# EasyEDA schematic SCH_wiring_diagram_phws_2026-05-13.json
TITLE: Wiring Diagram - Transmitter; REV: 1.0; Date: 2026-05-13; Sheet: 1/1; Drawn By: CES
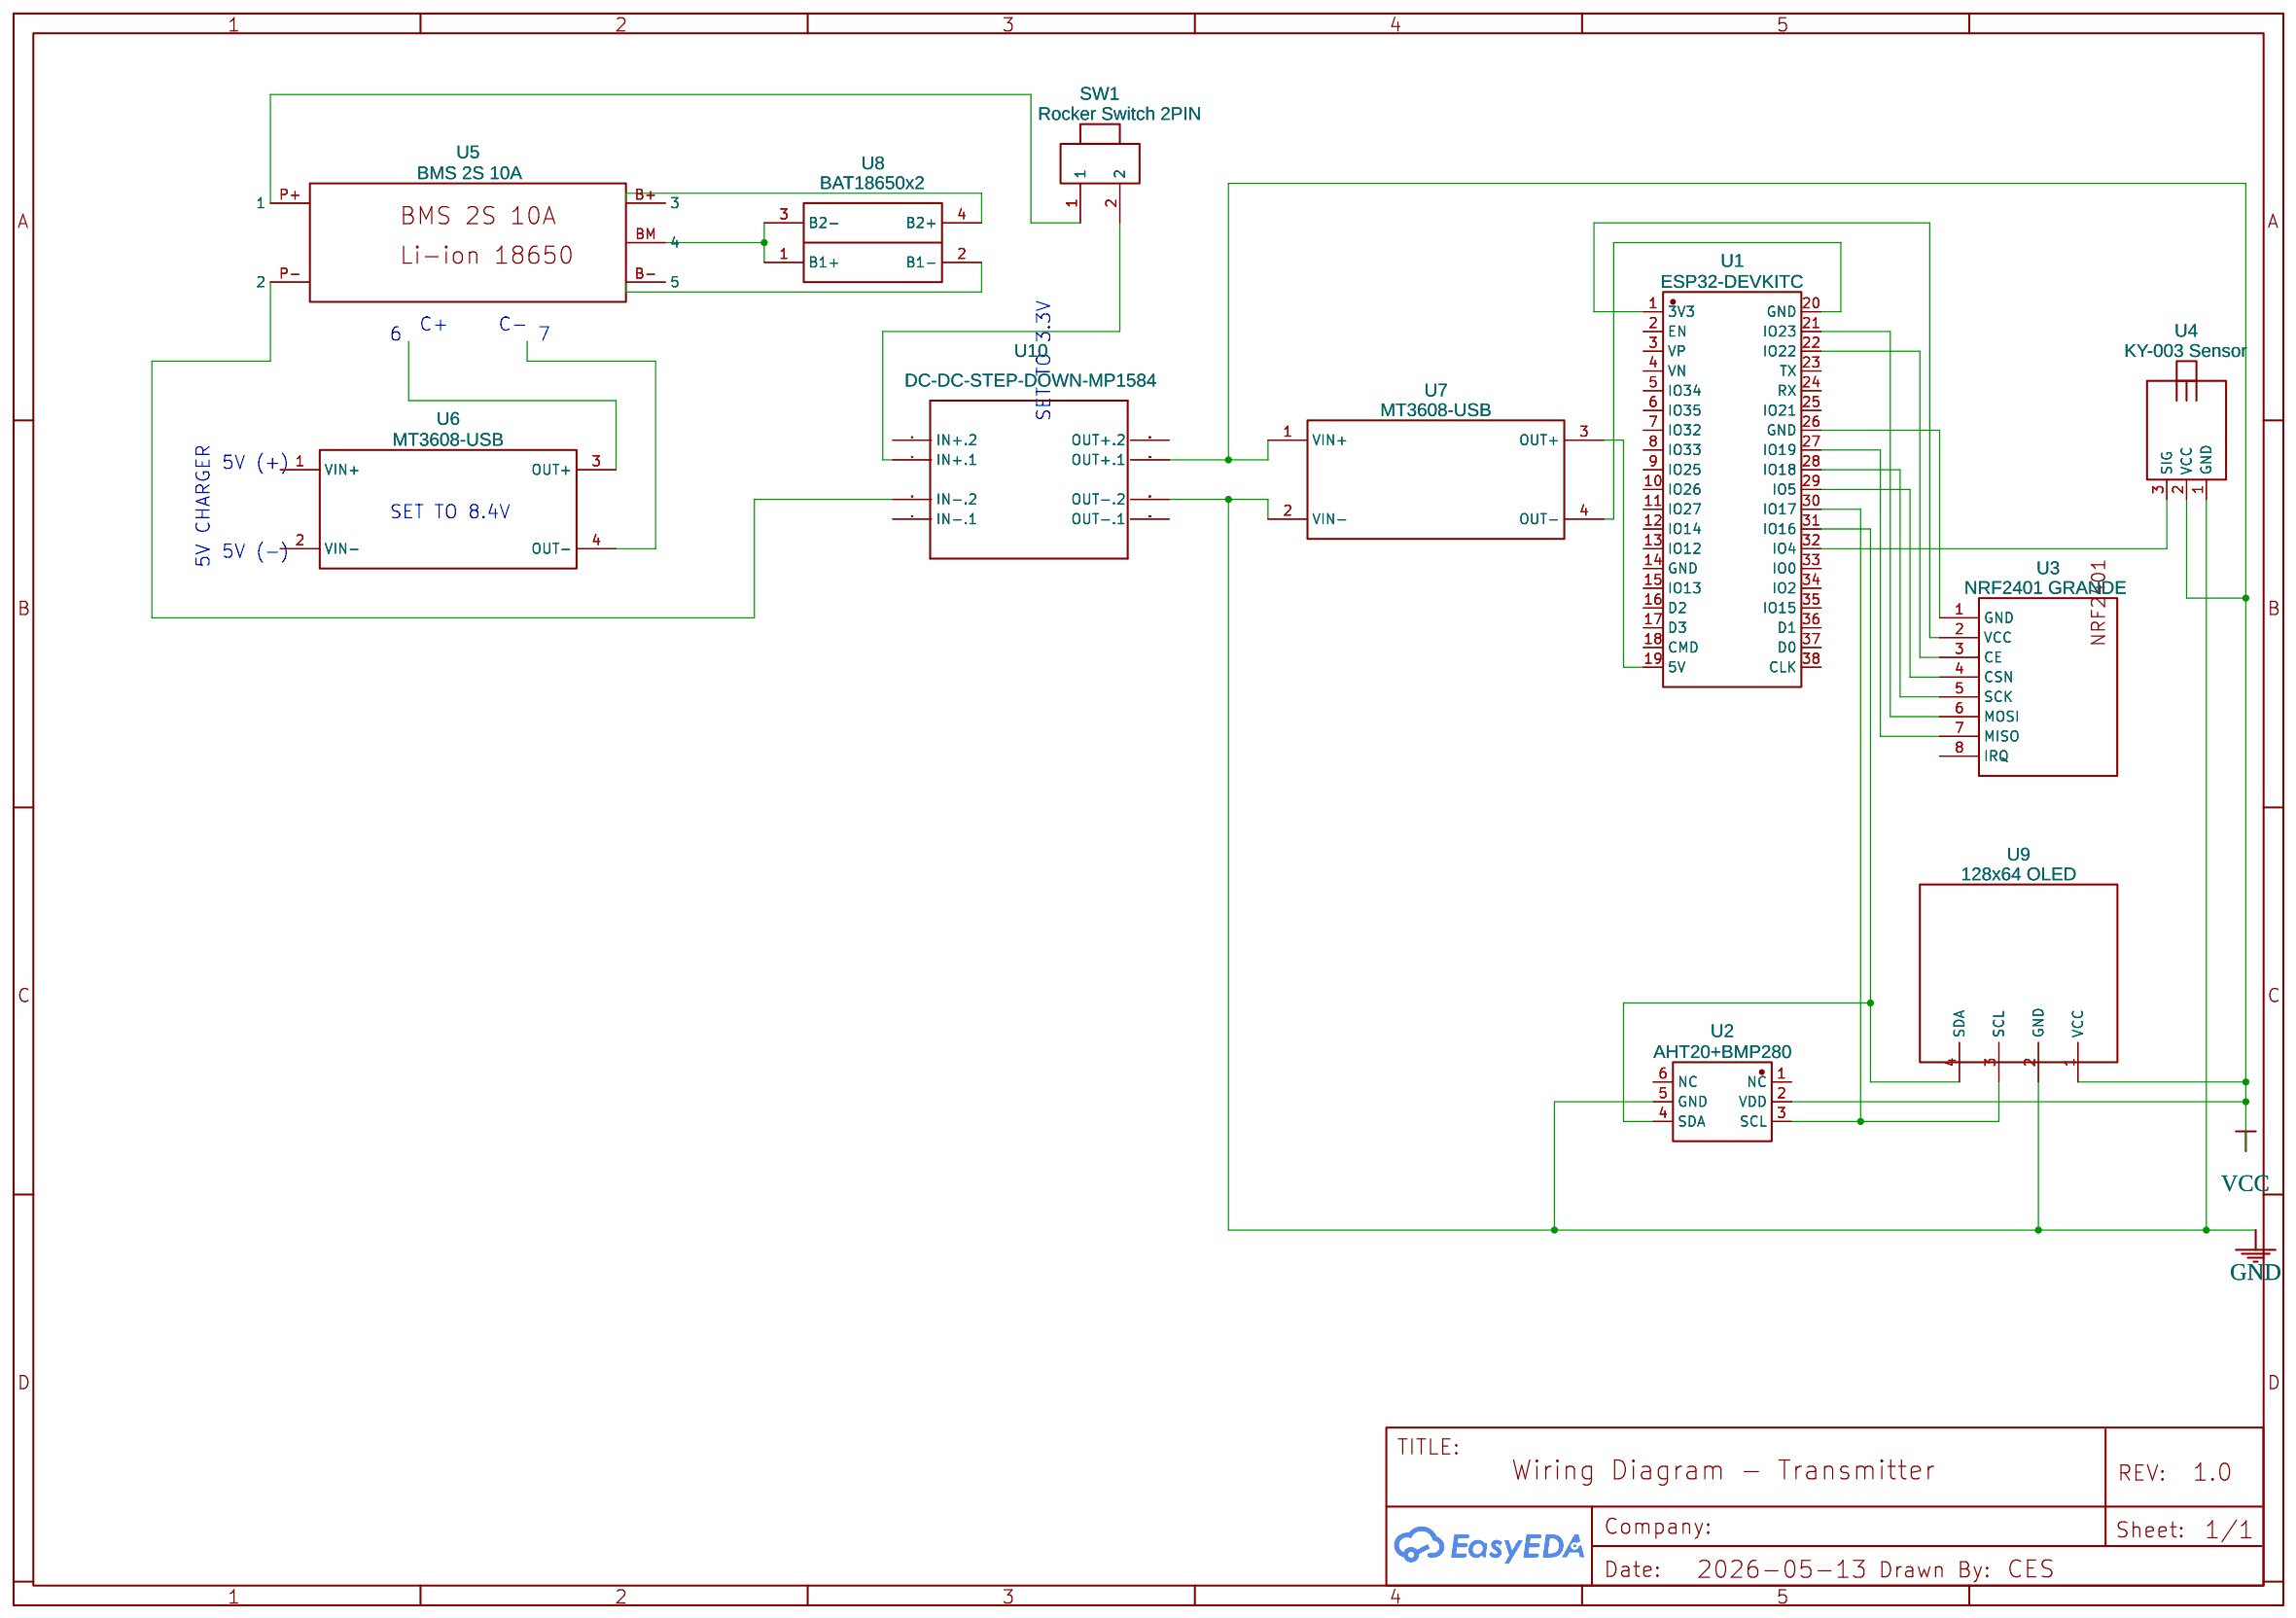
[diagram p0: schematic sheet]

## Parts
SW1  Rocker Switch 2PIN  [ROCKER-SWITCH-2P]
U1  ESP32-DEVKITC  [BULETM-SMD_ESP32-DEVKITC]
U2  AHT20+BMP280  [SENSOR-SMD-6_AHT20]
U3  NRF2401 GRANDE  [NRF2401+PA+LNA]
U4  KY-003 Sensor  [KY-003 HALL EFFECT SENSOR]
U5  BMS 2S 10A
U6  MT3608-USB  [DC-DC XL6009E1]
U7  MT3608-USB  [DC-DC XL6009E1]
U8  BAT18650x2
U9  128x64 OLED  [128X64-OLED-VCCGND]
U10  DC-DC-STEP-DOWN-MP1584  [DC-DC-STEP-DOWN-MP1584]

## Library data of the parts
SW1 = Rocker Switch 2PIN: Supplier: LCSC; Manufacturer: BBJ; Manufacturer Part: Rocker switch601-10211BB; Supplier Part: C67849; Contributor: Nainaiu Rakhaine
U1 = ESP32-DEVKITC: Supplier: LCSC; Supplier Part: C571180; Manufacturer: ESPRESSIF(乐鑫); Manufacturer Part: ESP32-DevKitC; Contributor: lcsc
U2 = AHT20-F: Contributor: lcsc; Supplier: LCSC; Supplier Part: C3012622; Manufacturer: 广州奥松; JLCPCB Part Class: Extended Part
U3 = NRF2401_GRANDE: Contributor: jgrogers
U4 = KY-003 Hall Effect Sensor: Contributor: marshallvisions
U5 = BMS 2S 10a C: Contributor: cedst333
U6 U7 = MT3608-USB: Contributor: paul.smits
U8 = BAT18650x2: Contributor: mkorzin
U9 = 128x64 Oled VCCat1 GNDat2: Contributor: tpra
U10 = DC-DC-STEP-DOWN-MP1584: Contributor: hollandacocobear

## Nets
GND: U2.5(GND) U4.1(GND) U7.2(VIN-) U9.2(GND) U10.OUT-.2
VCC: U2.2(VDD) U4.2(VCC) U7.1(VIN+) U9.1(VCC) U10.OUT+.1
Net-(SW1-1): SW1.1 U5.P+(1)
Net-(SW1-2): SW1.2 U10.IN+.1
Net-(U1-1): U1.1(3V3) U3.2(VCC)
Net-(U1-19): U1.19(5V) U7.3(OUT+)
Net-(U1-20): U1.20(GND) U7.4(OUT-)
Net-(U1-21): U1.21(IO23) U3.6(MOSI)
Net-(U1-22): U1.22(IO22) U3.3(CE)
Net-(U1-26): U1.26(GND) U3.1(GND)
Net-(U1-27): U1.27(IO19) U3.7(MISO)
Net-(U1-28): U1.28(IO18) U3.5(SCK)
Net-(U1-29): U1.29(IO5) U3.4(CSN)
Net-(U1-30): U1.30(IO17) U2.3(SCL) U9.3(SCL)
Net-(U1-31): U1.31(IO16) U2.4(SDA) U9.4(SDA)
Net-(U1-32): U1.32(IO4) U4.3(SIG)
Net-(U5-B+): U5.B+(3) U8.4(B2+)
Net-(U5-B-): U5.B-(5) U8.2(B1-)
Net-(U5-BM): U5.BM(4) U8.1(B1+) U8.3(B2-)
Net-(U5-P-): U5.P-(2) U10.IN-.2

Not connected (* = marked no-connect by the designer): U1 2(EN) 3(VP) 4(VN) 5(IO34) 6(IO35) 7(IO32) 8(IO33) 9(IO25) 10(IO26) 11(IO27) 12(IO14) 13(IO12) 14(GND) 15(IO13) 16(D2) 17(D3) 18(CMD) 23(TX) 24(RX) 25(IO21) 33(IO0) 34(IO2) 35(IO15) 36(D1) 37(D0) 38(CLK); U2 1(NC) 6(NC); U3 8(IRQ); U6 1(VIN+) 2(VIN-) 3(OUT+) 4(OUT-); U10 IN+.2 IN-.1 OUT+.2 OUT-.1

## Notes on the sheet
- 6
- C+
- C-
- 7
- SET TO 3.3V
- 5V (+)
- SET TO 8.4V
- 5V (-)
- 5V CHARGER
